# Altium schematic sheet ModDownCounter.SchDoc: LiveDesign Evaluation - Countdown
size A4; Organization: Altium Limited; Address1: L3, 12a Rodborough Rd; Address2: Frenchs Forest; Address3: NSW; Address4: Australia 2086; DocumentNumber: 2; SheetNumber: 2; SheetTotal: 3
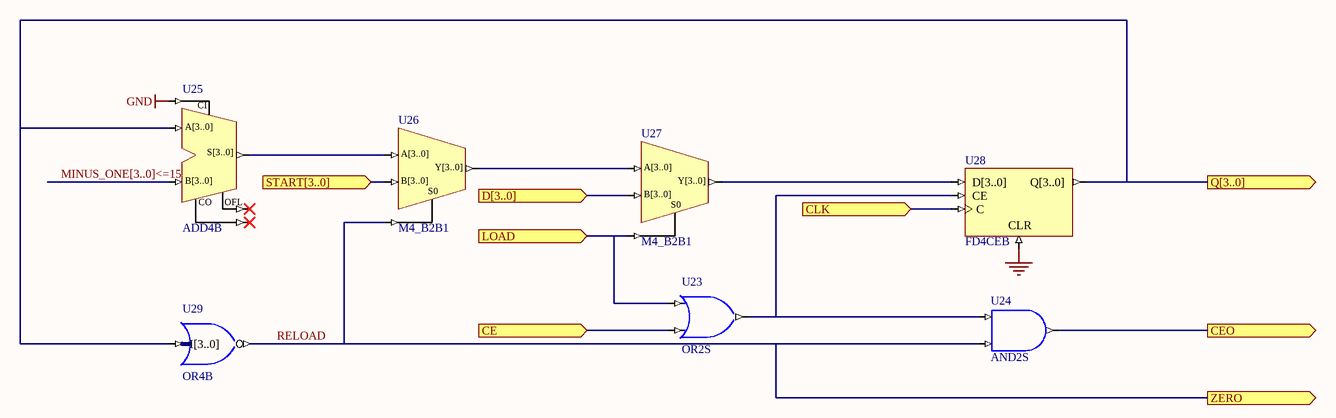
[diagram p0: ModDownCounter.SchDoc]

## Parts
U23  OR2S
U24  AND2S
U25  ADD4B
U26  M4_B2B1
U27  M4_B2B1
U28  FD4CEB
U29  OR4B

## Ports
CE (in), CEO (out), CLK (in), D[3..0] (in), LOAD (in), Q[3..0] (out), START[3..0] (in), ZERO (out)

## Nets
GND: U25.CI U28.CLR
CE: U23.I1 ; port CE
CEO: U24.O ; port CEO
CLK: U28.C ; port CLK
D[3..0]: U27.B[3..0] ; port D[3..0]
LOAD: U23.I0 U27.S0 ; port LOAD
MINUS_ONE[3..0]<=15: U25.B[3..0]
Q[3..0]: U25.A[3..0] U28.Q[3..0] U29.I[3..0] ; port Q[3..0]
RELOAD: U24.I1 U26.S0 U29.O ; port ZERO
START[3..0]: U26.B[3..0] ; port START[3..0]
NetU23_O: U23.O U24.I0 U28.CE
NetU25_S[3..0]: U25.S[3..0] U26.A[3..0]
NetU26_Y[3..0]: U26.Y[3..0] U27.A[3..0]
NetU27_Y[3..0]: U27.Y[3..0] U28.D[3..0]

Not connected (* = marked no-connect by the designer): U25 CO* OFL*

## Buses and harness runs
bus MINUS_ONE[3..0]<=15

## Notes on the sheet
- Title
- Size:
- Date:
- A4
- Number:
- Time:
- Revision:
- Sheet
- of
- File:

## Library data of the parts
U23 = OR2S: 2-Input OR Gate, Single Pin Version; ArchiveName: GENERIC; VHDLIB_SIM: GENERIC_LIB; Xilinx Equivalent: OR2; Published: 29-Jan-2004; Publisher: Altium Limited; Core Revision: 1.00.00
U24 = AND2S: 2-Input AND Gate, Single Pin Version; ArchiveName: GENERIC; VHDLIB_SIM: GENERIC_LIB; Xilinx Equivalent: AND2; Published: 29-Jan-2004; Publisher: Altium Limited; Core Revision: 1.00.00
U25 = ADD4B: 4-Bit Cascadable Full Adder with Signed and Unsigned Operations, Bus Version; ArchiveName: GENERIC; VHDLIB_SIM: GENERIC_LIB; Published: 29-Jan-2004; Publisher: Altium Limited; Core Revision: 1.00.00
U26 U27 = M4_B2B1: 2x4-Bit Bus to 1x4-Bit Bus Multiplexer; ArchiveName: GENERIC; VHDLIB_SIM: GENERIC_LIB; Published: 29-Jan-2004; Publisher: Altium Limited; Core Revision: 1.00.00
U28 = FD4CEB: 4-Bit D-Type Flip-Flop with Clock Enable and Asynchronous Clear, Bus Version; ArchiveName: GENERIC; VHDLIB_SIM: GENERIC_LIB; Published: 29-Jan-2004; Publisher: Altium Limited; Core Revision: 1.00.00
U29 = NOR4B: 4-Input NOR Gate, Bus Version; ArchiveName: GENERIC; VHDLIB_SIM: GENERIC_LIB; Published: 29-Jan-2004; Publisher: Altium Limited; Core Revision: 1.00.00